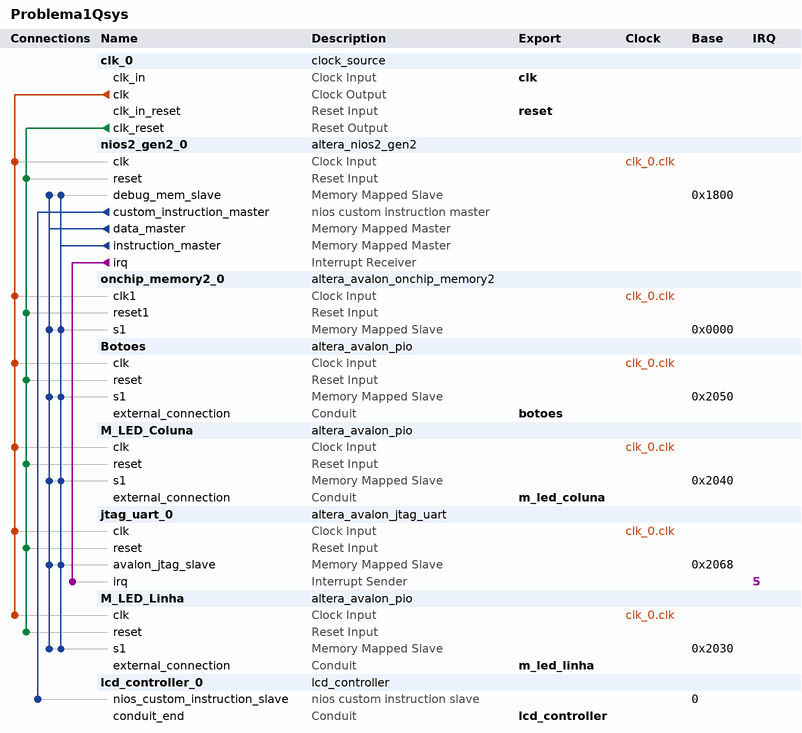
[diagram p0: system contents]
# Platform Designer (Qsys) system Problema1Qsys, Cyclone IV E EP4CE30F23C7
# Parameters at their usual value, and those the tool derives, are not listed.
package require -exact qsys 18.1
create_system Problema1Qsys
set_project_property DEVICE_FAMILY {Cyclone IV E}
set_project_property DEVICE EP4CE30F23C7

add_instance clk_0 clock_source 18.1
set_instance_parameter_value clk_0 clockFrequency 50000000

add_instance nios2_gen2_0 altera_nios2_gen2 18.1
set_instance_parameter_value nios2_gen2_0 dcache_size 2048
set_instance_parameter_value nios2_gen2_0 exceptionSlave onchip_memory2_0.s1
set_instance_parameter_value nios2_gen2_0 icache_size 4096
set_instance_parameter_value nios2_gen2_0 impl Tiny
set_instance_parameter_value nios2_gen2_0 resetSlave onchip_memory2_0.s1

add_instance onchip_memory2_0 altera_avalon_onchip_memory2 18.1
set_instance_parameter_value onchip_memory2_0 dataWidth 32
set_instance_parameter_value onchip_memory2_0 dualPort false
set_instance_parameter_value onchip_memory2_0 initMemContent true
set_instance_parameter_value onchip_memory2_0 initializationFileName onchip_mem.hex
set_instance_parameter_value onchip_memory2_0 memorySize 4096
set_instance_parameter_value onchip_memory2_0 useNonDefaultInitFile true

add_instance Botoes altera_avalon_pio 18.1
set_instance_parameter_value Botoes direction Input
set_instance_parameter_value Botoes width 4

add_instance M_LED_Coluna altera_avalon_pio 18.1
set_instance_parameter_value M_LED_Coluna direction Output
set_instance_parameter_value M_LED_Coluna width 5

add_instance jtag_uart_0 altera_avalon_jtag_uart 18.1
set_instance_parameter_value jtag_uart_0 simInteractiveOptions NO_INTERACTIVE_WINDOWS

add_instance M_LED_Linha altera_avalon_pio 18.1
set_instance_parameter_value M_LED_Linha direction Output
set_instance_parameter_value M_LED_Linha width 5

add_instance lcd_controller_0 lcd_controller 1.0

# connections
add_connection clk_0.clk Botoes.clk clock
add_connection clk_0.clk jtag_uart_0.clk clock
add_connection clk_0.clk M_LED_Coluna.clk clock
add_connection clk_0.clk M_LED_Linha.clk clock
add_connection clk_0.clk nios2_gen2_0.clk clock
add_connection clk_0.clk onchip_memory2_0.clk1 clock
add_connection clk_0.clk_reset Botoes.reset reset
add_connection clk_0.clk_reset jtag_uart_0.reset reset
add_connection clk_0.clk_reset M_LED_Coluna.reset reset
add_connection clk_0.clk_reset M_LED_Linha.reset reset
add_connection clk_0.clk_reset nios2_gen2_0.reset reset
add_connection clk_0.clk_reset onchip_memory2_0.reset1 reset
add_connection nios2_gen2_0.data_master Botoes.s1 avalon
set_connection_parameter_value nios2_gen2_0.data_master/Botoes.s1 baseAddress 0x2050
add_connection nios2_gen2_0.data_master jtag_uart_0.avalon_jtag_slave avalon
set_connection_parameter_value nios2_gen2_0.data_master/jtag_uart_0.avalon_jtag_slave baseAddress 0x2068
add_connection nios2_gen2_0.data_master M_LED_Coluna.s1 avalon
set_connection_parameter_value nios2_gen2_0.data_master/M_LED_Coluna.s1 baseAddress 0x2040
add_connection nios2_gen2_0.data_master M_LED_Linha.s1 avalon
set_connection_parameter_value nios2_gen2_0.data_master/M_LED_Linha.s1 baseAddress 0x2030
add_connection nios2_gen2_0.data_master nios2_gen2_0.debug_mem_slave avalon
set_connection_parameter_value nios2_gen2_0.data_master/nios2_gen2_0.debug_mem_slave baseAddress 0x1800
add_connection nios2_gen2_0.data_master onchip_memory2_0.s1 avalon
set_connection_parameter_value nios2_gen2_0.data_master/onchip_memory2_0.s1 baseAddress 0x0000
add_connection nios2_gen2_0.instruction_master Botoes.s1 avalon
set_connection_parameter_value nios2_gen2_0.instruction_master/Botoes.s1 baseAddress 0x2050
add_connection nios2_gen2_0.instruction_master jtag_uart_0.avalon_jtag_slave avalon
set_connection_parameter_value nios2_gen2_0.instruction_master/jtag_uart_0.avalon_jtag_slave baseAddress 0x2068
add_connection nios2_gen2_0.instruction_master M_LED_Coluna.s1 avalon
set_connection_parameter_value nios2_gen2_0.instruction_master/M_LED_Coluna.s1 baseAddress 0x2040
add_connection nios2_gen2_0.instruction_master M_LED_Linha.s1 avalon
set_connection_parameter_value nios2_gen2_0.instruction_master/M_LED_Linha.s1 baseAddress 0x2030
add_connection nios2_gen2_0.instruction_master nios2_gen2_0.debug_mem_slave avalon
set_connection_parameter_value nios2_gen2_0.instruction_master/nios2_gen2_0.debug_mem_slave baseAddress 0x1800
add_connection nios2_gen2_0.instruction_master onchip_memory2_0.s1 avalon
set_connection_parameter_value nios2_gen2_0.instruction_master/onchip_memory2_0.s1 baseAddress 0x0000
add_connection nios2_gen2_0.irq jtag_uart_0.irq interrupt
set_connection_parameter_value nios2_gen2_0.irq/jtag_uart_0.irq irqNumber 5
add_connection nios2_gen2_0.custom_instruction_master lcd_controller_0.nios_custom_instruction_slave nios_custom_instruction
set_connection_parameter_value nios2_gen2_0.custom_instruction_master/lcd_controller_0.nios_custom_instruction_slave CIName lcd_controller_0
set_connection_parameter_value nios2_gen2_0.custom_instruction_master/lcd_controller_0.nios_custom_instruction_slave baseAddress 0

# exported interfaces
add_interface botoes conduit end
set_interface_property botoes EXPORT_OF Botoes.external_connection
add_interface clk clock sink
set_interface_property clk EXPORT_OF clk_0.clk_in
add_interface lcd_controller conduit end
set_interface_property lcd_controller EXPORT_OF lcd_controller_0.conduit_end
add_interface m_led_coluna conduit end
set_interface_property m_led_coluna EXPORT_OF M_LED_Coluna.external_connection
add_interface m_led_linha conduit end
set_interface_property m_led_linha EXPORT_OF M_LED_Linha.external_connection
add_interface reset reset sink
set_interface_property reset EXPORT_OF clk_0.clk_in_reset

set_interconnect_requirement {$system} qsys_mm.clockCrossingAdapter HANDSHAKE
set_interconnect_requirement {$system} qsys_mm.enableEccProtection FALSE
set_interconnect_requirement {$system} qsys_mm.insertDefaultSlave FALSE
set_interconnect_requirement {$system} qsys_mm.maxAdditionalLatency 1

save_system Problema1Qsys.qsys
